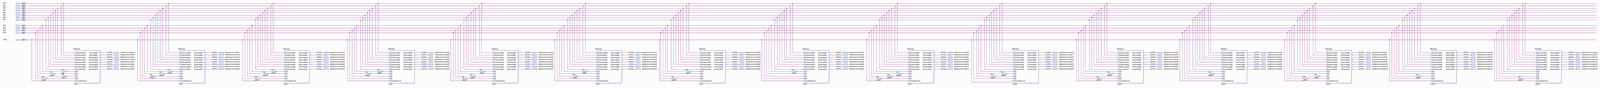
[diagram p0: schematic sheet, whole]
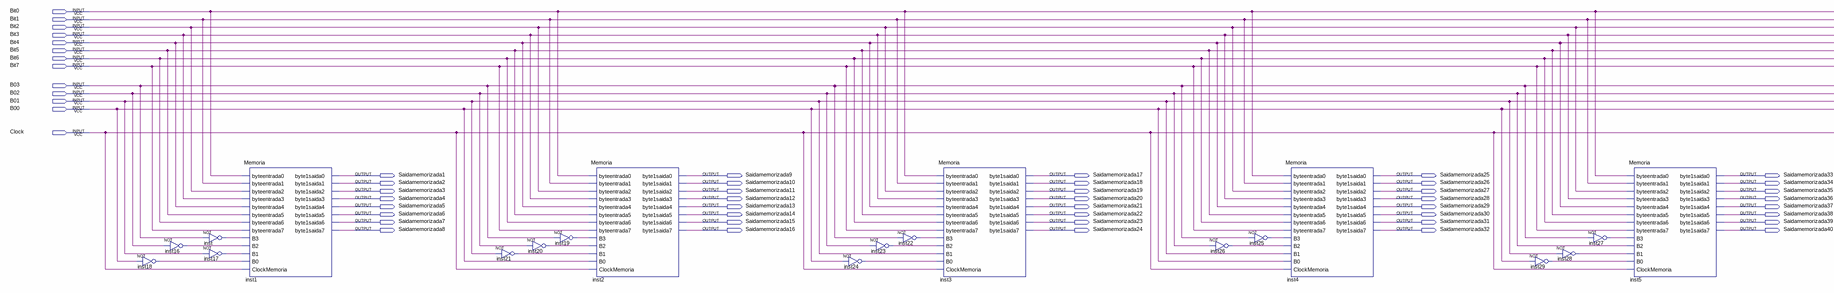
[diagram p1: schematic sheet, left part]
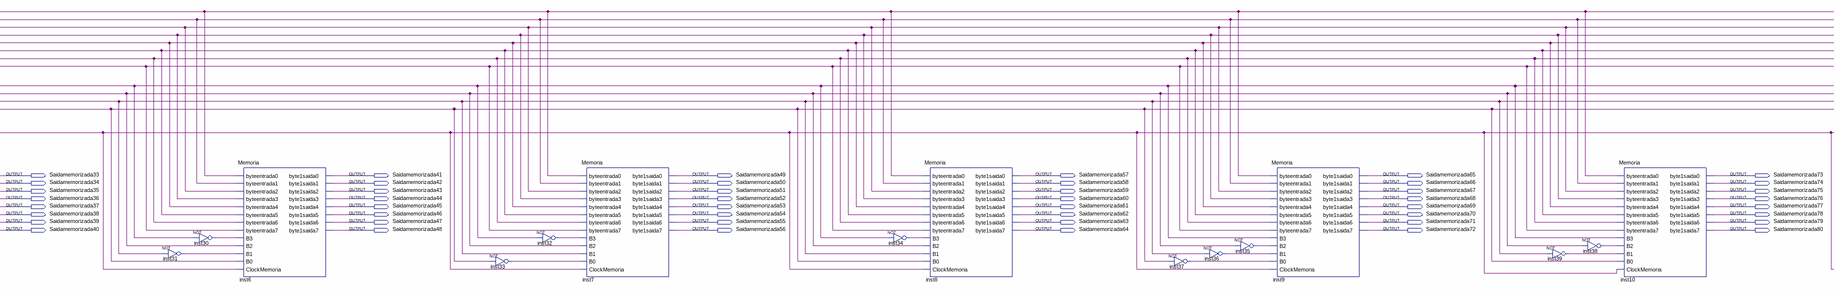
[diagram p2: schematic sheet, centre part]
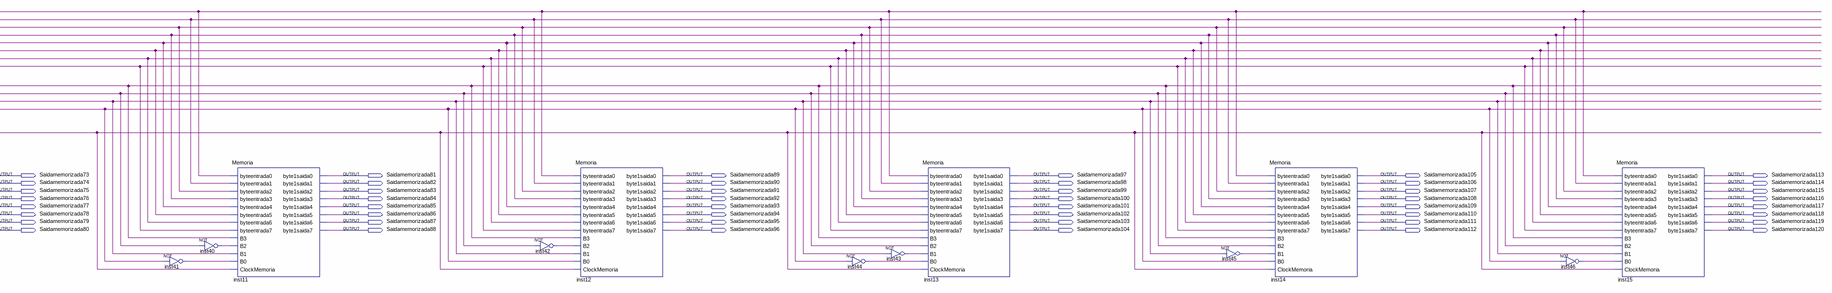
[diagram p3: schematic sheet, right part]
// Quartus schematic BatalhaNaval.bdf as structural Verilog: 47 symbols, 133 pins
module BatalhaNaval (
  input  Bit0,
  input  Bit1,
  input  Bit2,
  input  Bit3,
  input  Bit4,
  input  Bit5,
  input  Bit6,
  input  Bit7,
  input  B03,
  input  B02,
  input  B01,
  input  B00,
  input  Clock,
  output Saidamemorizada1,
  output Saidamemorizada9,
  output Saidamemorizada17,
  output Saidamemorizada25,
  output Saidamemorizada33,
  output Saidamemorizada41,
  output Saidamemorizada49,
  output Saidamemorizada57,
  output Saidamemorizada65,
  output Saidamemorizada73,
  output Saidamemorizada81,
  output Saidamemorizada89,
  output Saidamemorizada97,
  output Saidamemorizada105,
  output Saidamemorizada113,
  output Saidamemorizada2,
  output Saidamemorizada10,
  output Saidamemorizada18,
  output Saidamemorizada26,
  output Saidamemorizada34,
  output Saidamemorizada42,
  output Saidamemorizada50,
  output Saidamemorizada58,
  output Saidamemorizada66,
  output Saidamemorizada74,
  output Saidamemorizada82,
  output Saidamemorizada90,
  output Saidamemorizada98,
  output Saidamemorizada106,
  output Saidamemorizada114,
  output Saidamemorizada3,
  output Saidamemorizada11,
  output Saidamemorizada19,
  output Saidamemorizada27,
  output Saidamemorizada35,
  output Saidamemorizada43,
  output Saidamemorizada51,
  output Saidamemorizada59,
  output Saidamemorizada67,
  output Saidamemorizada75,
  output Saidamemorizada83,
  output Saidamemorizada91,
  output Saidamemorizada99,
  output Saidamemorizada107,
  output Saidamemorizada115,
  output Saidamemorizada4,
  output Saidamemorizada12,
  output Saidamemorizada20,
  output Saidamemorizada28,
  output Saidamemorizada36,
  output Saidamemorizada44,
  output Saidamemorizada52,
  output Saidamemorizada60,
  output Saidamemorizada68,
  output Saidamemorizada76,
  output Saidamemorizada84,
  output Saidamemorizada92,
  output Saidamemorizada100,
  output Saidamemorizada108,
  output Saidamemorizada116,
  output Saidamemorizada5,
  output Saidamemorizada13,
  output Saidamemorizada21,
  output Saidamemorizada29,
  output Saidamemorizada37,
  output Saidamemorizada45,
  output Saidamemorizada53,
  output Saidamemorizada61,
  output Saidamemorizada69,
  output Saidamemorizada77,
  output Saidamemorizada85,
  output Saidamemorizada93,
  output Saidamemorizada101,
  output Saidamemorizada109,
  output Saidamemorizada117,
  output Saidamemorizada6,
  output Saidamemorizada14,
  output Saidamemorizada22,
  output Saidamemorizada30,
  output Saidamemorizada38,
  output Saidamemorizada46,
  output Saidamemorizada54,
  output Saidamemorizada62,
  output Saidamemorizada70,
  output Saidamemorizada78,
  output Saidamemorizada86,
  output Saidamemorizada94,
  output Saidamemorizada102,
  output Saidamemorizada110,
  output Saidamemorizada118,
  output Saidamemorizada7,
  output Saidamemorizada15,
  output Saidamemorizada23,
  output Saidamemorizada31,
  output Saidamemorizada39,
  output Saidamemorizada47,
  output Saidamemorizada55,
  output Saidamemorizada63,
  output Saidamemorizada71,
  output Saidamemorizada79,
  output Saidamemorizada87,
  output Saidamemorizada95,
  output Saidamemorizada103,
  output Saidamemorizada111,
  output Saidamemorizada119,
  output Saidamemorizada8,
  output Saidamemorizada16,
  output Saidamemorizada24,
  output Saidamemorizada32,
  output Saidamemorizada40,
  output Saidamemorizada48,
  output Saidamemorizada56,
  output Saidamemorizada64,
  output Saidamemorizada72,
  output Saidamemorizada80,
  output Saidamemorizada88,
  output Saidamemorizada96,
  output Saidamemorizada104,
  output Saidamemorizada112,
  output Saidamemorizada120
);

  wire inst16_out, inst17_out, inst18_out, inst19_out, inst20_out, inst21_out, inst22_out, inst23_out,
       inst24_out, inst25_out, inst26_out, inst27_out, inst28_out, inst29_out, inst30_out, inst31_out,
       inst32_out, inst33_out, inst34_out, inst35_out, inst36_out, inst37_out, inst38_out, inst39_out,
       inst40_out, inst41_out, inst42_out, inst43_out, inst44_out, inst45_out, inst46_out, inst_out;

  not inst18 (inst18_out, B00);
  not inst16 (inst16_out, B02);
  not inst (inst_out, B03);
  not inst17 (inst17_out, B01);
  Memoria inst1 (
    .byteentrada0(Bit0), .byteentrada1(Bit1), .byteentrada2(Bit2), .byteentrada3(Bit3), .byteentrada4(Bit4),
    .byteentrada5(Bit5), .byteentrada6(Bit6), .byteentrada7(Bit7), .B3(inst_out), .B2(inst16_out),
    .B1(inst17_out), .B0(inst18_out), .ClockMemoria(Clock), .byte1saida0(Saidamemorizada1),
    .byte1saida1(Saidamemorizada2), .byte1saida2(Saidamemorizada3), .byte1saida3(Saidamemorizada4),
    .byte1saida4(Saidamemorizada5), .byte1saida5(Saidamemorizada6), .byte1saida6(Saidamemorizada7),
    .byte1saida7(Saidamemorizada8));
  not inst21 (inst21_out, B01);
  not inst19 (inst19_out, B03);
  not inst20 (inst20_out, B02);
  Memoria inst2 (
    .byteentrada0(Bit0), .byteentrada1(Bit1), .byteentrada2(Bit2), .byteentrada3(Bit3), .byteentrada4(Bit4),
    .byteentrada5(Bit5), .byteentrada6(Bit6), .byteentrada7(Bit7), .B3(inst19_out), .B2(inst20_out),
    .B1(inst21_out), .B0(B00), .ClockMemoria(Clock), .byte1saida0(Saidamemorizada9),
    .byte1saida1(Saidamemorizada10), .byte1saida2(Saidamemorizada11), .byte1saida3(Saidamemorizada12),
    .byte1saida4(Saidamemorizada13), .byte1saida5(Saidamemorizada14), .byte1saida6(Saidamemorizada15),
    .byte1saida7(Saidamemorizada16));
  not inst24 (inst24_out, B00);
  not inst22 (inst22_out, B03);
  not inst23 (inst23_out, B02);
  Memoria inst3 (
    .byteentrada0(Bit0), .byteentrada1(Bit1), .byteentrada2(Bit2), .byteentrada3(Bit3), .byteentrada4(Bit4),
    .byteentrada5(Bit5), .byteentrada6(Bit6), .byteentrada7(Bit7), .B3(inst22_out), .B2(inst23_out),
    .B1(B01), .B0(inst24_out), .ClockMemoria(Clock), .byte1saida0(Saidamemorizada17),
    .byte1saida1(Saidamemorizada18), .byte1saida2(Saidamemorizada19), .byte1saida3(Saidamemorizada20),
    .byte1saida4(Saidamemorizada21), .byte1saida5(Saidamemorizada22), .byte1saida6(Saidamemorizada23),
    .byte1saida7(Saidamemorizada24));
  not inst26 (inst26_out, B02);
  not inst25 (inst25_out, B03);
  Memoria inst4 (
    .byteentrada0(Bit0), .byteentrada1(Bit1), .byteentrada2(Bit2), .byteentrada3(Bit3), .byteentrada4(Bit4),
    .byteentrada5(Bit5), .byteentrada6(Bit6), .byteentrada7(Bit7), .B3(inst25_out), .B2(inst26_out),
    .B1(B01), .B0(B00), .ClockMemoria(Clock), .byte1saida0(Saidamemorizada25),
    .byte1saida1(Saidamemorizada26), .byte1saida2(Saidamemorizada27), .byte1saida3(Saidamemorizada28),
    .byte1saida4(Saidamemorizada29), .byte1saida5(Saidamemorizada30), .byte1saida6(Saidamemorizada31),
    .byte1saida7(Saidamemorizada32));
  not inst29 (inst29_out, B00);
  not inst28 (inst28_out, B01);
  not inst27 (inst27_out, B03);
  Memoria inst5 (
    .byteentrada0(Bit0), .byteentrada1(Bit1), .byteentrada2(Bit2), .byteentrada3(Bit3), .byteentrada4(Bit4),
    .byteentrada5(Bit5), .byteentrada6(Bit6), .byteentrada7(Bit7), .B3(inst27_out), .B2(B02),
    .B1(inst28_out), .B0(inst29_out), .ClockMemoria(Clock), .byte1saida0(Saidamemorizada33),
    .byte1saida1(Saidamemorizada34), .byte1saida2(Saidamemorizada35), .byte1saida3(Saidamemorizada36),
    .byte1saida4(Saidamemorizada37), .byte1saida5(Saidamemorizada38), .byte1saida6(Saidamemorizada39),
    .byte1saida7(Saidamemorizada40));
  not inst31 (inst31_out, B01);
  not inst30 (inst30_out, B03);
  Memoria inst6 (
    .byteentrada0(Bit0), .byteentrada1(Bit1), .byteentrada2(Bit2), .byteentrada3(Bit3), .byteentrada4(Bit4),
    .byteentrada5(Bit5), .byteentrada6(Bit6), .byteentrada7(Bit7), .B3(inst30_out), .B2(B02),
    .B1(inst31_out), .B0(B00), .ClockMemoria(Clock), .byte1saida0(Saidamemorizada41),
    .byte1saida1(Saidamemorizada42), .byte1saida2(Saidamemorizada43), .byte1saida3(Saidamemorizada44),
    .byte1saida4(Saidamemorizada45), .byte1saida5(Saidamemorizada46), .byte1saida6(Saidamemorizada47),
    .byte1saida7(Saidamemorizada48));
  not inst33 (inst33_out, B00);
  not inst32 (inst32_out, B03);
  Memoria inst7 (
    .byteentrada0(Bit0), .byteentrada1(Bit1), .byteentrada2(Bit2), .byteentrada3(Bit3), .byteentrada4(Bit4),
    .byteentrada5(Bit5), .byteentrada6(Bit6), .byteentrada7(Bit7), .B3(inst32_out), .B2(B02), .B1(B01),
    .B0(inst33_out), .ClockMemoria(Clock), .byte1saida0(Saidamemorizada49), .byte1saida1(Saidamemorizada50),
    .byte1saida2(Saidamemorizada51), .byte1saida3(Saidamemorizada52), .byte1saida4(Saidamemorizada53),
    .byte1saida5(Saidamemorizada54), .byte1saida6(Saidamemorizada55), .byte1saida7(Saidamemorizada56));
  not inst34 (inst34_out, B03);
  Memoria inst8 (
    .byteentrada0(Bit0), .byteentrada1(Bit1), .byteentrada2(Bit2), .byteentrada3(Bit3), .byteentrada4(Bit4),
    .byteentrada5(Bit5), .byteentrada6(Bit6), .byteentrada7(Bit7), .B3(inst34_out), .B2(B02), .B1(B01),
    .B0(B00), .ClockMemoria(Clock), .byte1saida0(Saidamemorizada57), .byte1saida1(Saidamemorizada58),
    .byte1saida2(Saidamemorizada59), .byte1saida3(Saidamemorizada60), .byte1saida4(Saidamemorizada61),
    .byte1saida5(Saidamemorizada62), .byte1saida6(Saidamemorizada63), .byte1saida7(Saidamemorizada64));
  not inst37 (inst37_out, B00);
  not inst36 (inst36_out, B01);
  not inst35 (inst35_out, B02);
  Memoria inst9 (
    .byteentrada0(Bit0), .byteentrada1(Bit1), .byteentrada2(Bit2), .byteentrada3(Bit3), .byteentrada4(Bit4),
    .byteentrada5(Bit5), .byteentrada6(Bit6), .byteentrada7(Bit7), .B3(B03), .B2(inst35_out),
    .B1(inst36_out), .B0(inst37_out), .ClockMemoria(Clock), .byte1saida0(Saidamemorizada65),
    .byte1saida1(Saidamemorizada66), .byte1saida2(Saidamemorizada67), .byte1saida3(Saidamemorizada68),
    .byte1saida4(Saidamemorizada69), .byte1saida5(Saidamemorizada70), .byte1saida6(Saidamemorizada71),
    .byte1saida7(Saidamemorizada72));
  not inst39 (inst39_out, B01);
  not inst38 (inst38_out, B02);
  Memoria inst10 (
    .byteentrada0(Bit0), .byteentrada1(Bit1), .byteentrada2(Bit2), .byteentrada3(Bit3), .byteentrada4(Bit4),
    .byteentrada5(Bit5), .byteentrada6(Bit6), .byteentrada7(Bit7), .B3(B03), .B2(inst38_out),
    .B1(inst39_out), .B0(B00), .ClockMemoria(Clock), .byte1saida0(Saidamemorizada73),
    .byte1saida1(Saidamemorizada74), .byte1saida2(Saidamemorizada75), .byte1saida3(Saidamemorizada76),
    .byte1saida4(Saidamemorizada77), .byte1saida5(Saidamemorizada78), .byte1saida6(Saidamemorizada79),
    .byte1saida7(Saidamemorizada80));
  not inst41 (inst41_out, B00);
  not inst40 (inst40_out, B02);
  Memoria inst11 (
    .byteentrada0(Bit0), .byteentrada1(Bit1), .byteentrada2(Bit2), .byteentrada3(Bit3), .byteentrada4(Bit4),
    .byteentrada5(Bit5), .byteentrada6(Bit6), .byteentrada7(Bit7), .B3(B03), .B2(inst40_out), .B1(B01),
    .B0(inst41_out), .ClockMemoria(Clock), .byte1saida0(Saidamemorizada81), .byte1saida1(Saidamemorizada82),
    .byte1saida2(Saidamemorizada83), .byte1saida3(Saidamemorizada84), .byte1saida4(Saidamemorizada85),
    .byte1saida5(Saidamemorizada86), .byte1saida6(Saidamemorizada87), .byte1saida7(Saidamemorizada88));
  not inst42 (inst42_out, B02);
  Memoria inst12 (
    .byteentrada0(Bit0), .byteentrada1(Bit1), .byteentrada2(Bit2), .byteentrada3(Bit3), .byteentrada4(Bit4),
    .byteentrada5(Bit5), .byteentrada6(Bit6), .byteentrada7(Bit7), .B3(B03), .B2(inst42_out), .B1(B01),
    .B0(B00), .ClockMemoria(Clock), .byte1saida0(Saidamemorizada89), .byte1saida1(Saidamemorizada90),
    .byte1saida2(Saidamemorizada91), .byte1saida3(Saidamemorizada92), .byte1saida4(Saidamemorizada93),
    .byte1saida5(Saidamemorizada94), .byte1saida6(Saidamemorizada95), .byte1saida7(Saidamemorizada96));
  not inst44 (inst44_out, B00);
  not inst43 (inst43_out, B01);
  Memoria inst13 (
    .byteentrada0(Bit0), .byteentrada1(Bit1), .byteentrada2(Bit2), .byteentrada3(Bit3), .byteentrada4(Bit4),
    .byteentrada5(Bit5), .byteentrada6(Bit6), .byteentrada7(Bit7), .B3(B03), .B2(B02), .B1(inst43_out),
    .B0(inst44_out), .ClockMemoria(Clock), .byte1saida0(Saidamemorizada97), .byte1saida1(Saidamemorizada98),
    .byte1saida2(Saidamemorizada99), .byte1saida3(Saidamemorizada100), .byte1saida4(Saidamemorizada101),
    .byte1saida5(Saidamemorizada102), .byte1saida6(Saidamemorizada103), .byte1saida7(Saidamemorizada104));
  not inst45 (inst45_out, B01);
  Memoria inst14 (
    .byteentrada0(Bit0), .byteentrada1(Bit1), .byteentrada2(Bit2), .byteentrada3(Bit3), .byteentrada4(Bit4),
    .byteentrada5(Bit5), .byteentrada6(Bit6), .byteentrada7(Bit7), .B3(B03), .B2(B02), .B1(inst45_out),
    .B0(B00), .ClockMemoria(Clock), .byte1saida0(Saidamemorizada105), .byte1saida1(Saidamemorizada106),
    .byte1saida2(Saidamemorizada107), .byte1saida3(Saidamemorizada108), .byte1saida4(Saidamemorizada109),
    .byte1saida5(Saidamemorizada110), .byte1saida6(Saidamemorizada111), .byte1saida7(Saidamemorizada112));
  not inst46 (inst46_out, B00);
  Memoria inst15 (
    .byteentrada0(Bit0), .byteentrada1(Bit1), .byteentrada2(Bit2), .byteentrada3(Bit3), .byteentrada4(Bit4),
    .byteentrada5(Bit5), .byteentrada6(Bit6), .byteentrada7(Bit7), .B3(B03), .B2(B02), .B1(B01),
    .B0(inst46_out), .ClockMemoria(Clock), .byte1saida0(Saidamemorizada113),
    .byte1saida1(Saidamemorizada114), .byte1saida2(Saidamemorizada115), .byte1saida3(Saidamemorizada116),
    .byte1saida4(Saidamemorizada117), .byte1saida5(Saidamemorizada118), .byte1saida6(Saidamemorizada119),
    .byte1saida7(Saidamemorizada120));
endmodule
